# Altium schematic sheet AudioADC.SchDoc
size A4; SheetNumber: 3; SheetTotal: 4
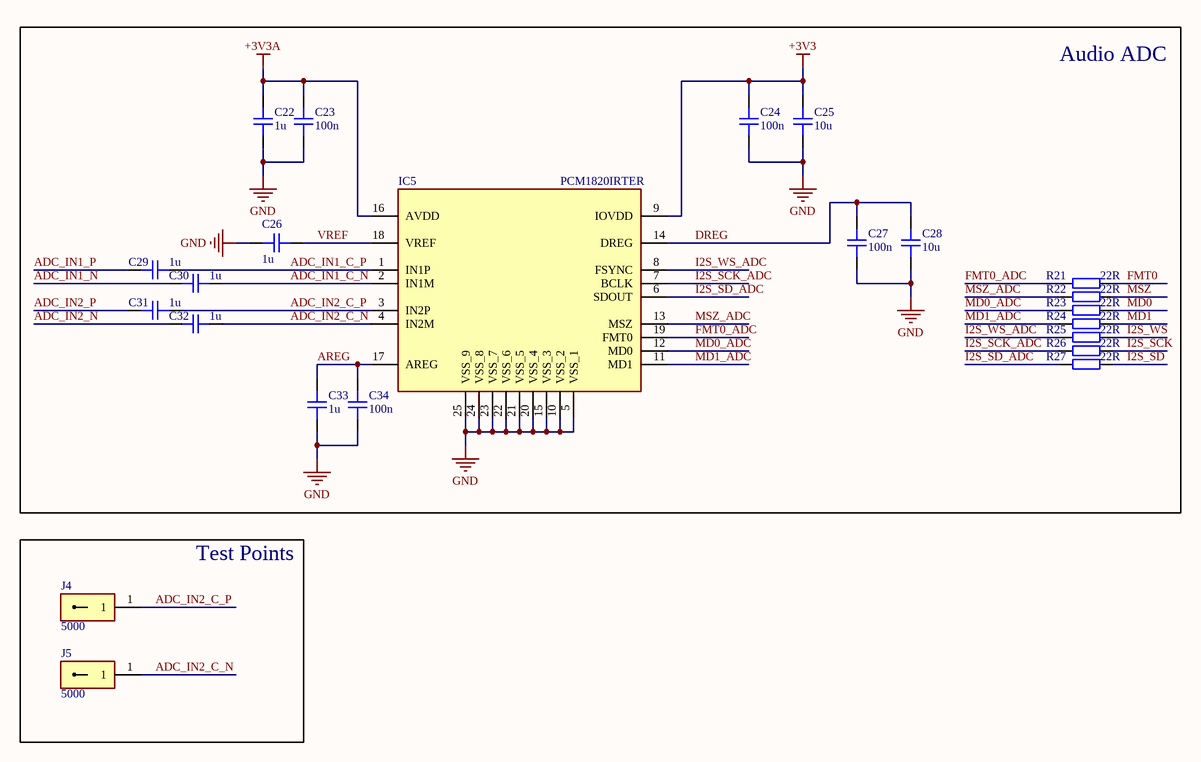
[diagram p0: AudioADC.SchDoc]

## Parts
C22  1u  [CAP_0603]
C23  100n  [CAP_0402]
C24  100n  [CAP_0402]
C25  10u  [CAP_0603]
C26  1u  [CAP_0402]
C27  100n  [CAP_0402]
C28  10u  [CAP_0603]
C29  1u  [CAP_0402]
C30  1u  [CAP_0402]
C31  1u  [CAP_0402]
C32  1u  [CAP_0402]
C33  1u  [CAP_0603]
C34  100n  [CAP_0402]
IC5  PCM1820IRTER  [PCM1820IRTER]
J4  5000  [5000]
J5  5000  [5000]
R21  22R  [RES_0402]
R22  22R  [RES_0402]
R23  22R  [RES_0402]
R24  22R  [RES_0402]
R25  22R  [RES_0402]
R26  22R  [RES_0402]
R27  22R  [RES_0402]

## Blocks framed on the sheet
Audio ADC: C22-C34 IC5 R21-R27
Test Points: J4 J5

## Nets
+3V3: C24.2 C25.2 IC5.9(IOVDD)
+3V3A: C22.2 C23.2 IC5.16(AVDD)
GND: C22.1 C23.1 C24.1 C25.1 C26.1 C27.1 C28.1 C33.1 C34.1 IC5.5(VSS_1) IC5.10(VSS_2) IC5.15(VSS_3) IC5.20(VSS_4) IC5.21(VSS_5) IC5.22(VSS_6) IC5.23(VSS_7) IC5.24(VSS_8) IC5.25(VSS_9)
ADC_IN1_C_N: C30.2 IC5.2(IN1M)
ADC_IN1_C_P: C29.2 IC5.1(IN1P)
ADC_IN1_N: C30.1
ADC_IN1_P: C29.1
ADC_IN2_C_N: C32.2 IC5.4(IN2M) J5.1
ADC_IN2_C_P: C31.2 IC5.3(IN2P) J4.1
ADC_IN2_N: C32.1
ADC_IN2_P: C31.1
AREG: C33.2 C34.2 IC5.17(AREG)
DREG: C27.2 C28.2 IC5.14(DREG)
FMT0: R21.2
FMT0_ADC: IC5.19(FMT0) R21.1
I2S_SCK: R26.2
I2S_SCK_ADC: IC5.7(BCLK) R26.1
I2S_SD: R27.2
I2S_SD_ADC: IC5.6(SDOUT) R27.1
I2S_WS: R25.2
I2S_WS_ADC: IC5.8(FSYNC) R25.1
MD0: R23.2
MD0_ADC: IC5.12(MD0) R23.1
MD1: R24.2
MD1_ADC: IC5.11(MD1) R24.1
MSZ: R22.2
MSZ_ADC: IC5.13(MSZ) R22.1
VREF: C26.2 IC5.18(VREF)

## Library data of the parts
C22 C25 C28 C33 = CAP_0603: Capacitor SMD 0603; Manufacturer: *; Manufacturer Part Number: *; Distributor Link: *; LCSC: *; Rating: *; Dielectric: *
C23 C24 C26 C27 C29-C32 C34 = CAP_0402: Capacitor SMD 0402; Manufacturer: *; Manufacturer Part Number: *; Distributor Link: *; LCSC: *; Rating: *; Dielectric: *
IC5 = PCM1820IRTER: Integrated Circuit; Manufacturer_Name: Texas Instruments; Datasheet Link: https://www.ti.com/lit/gpn/PCM1820; Height: 0.8mm; Manufacturer_Part_Number: PCM1820IRTER; Mouser Part Number: 595-PCM1820IRTER; Mouser Price/Stock: https://www.mouser.co.uk/ProductDetail/Texas-Instruments/PCM1820IRTER?qs=QNEnbhJQKvZFgZSjg2VzHg%3D%3D; Arrow Part Number: PCM1820IRTER; Arrow Price/Stock: https://www.arrow.com/en/products/pcm1820irter/texas-instruments?region=nac
J4 J5 = 5000: Connector; Manufacturer_Name: Keystone Electronics; Datasheet Link: http://www.keyelco.com/product-pdf.cfm?p=1309; Manufacturer_Part_Number: 5000; Mouser Part Number: 534-5000; Mouser Price/Stock: https://www.mouser.co.uk/ProductDetail/Keystone-Electronics/5000?qs=q0tsjPZWdm%252B9SiiTAbEwUw%3D%3D; Arrow Part Number: 5000; Arrow Price/Stock: https://www.arrow.com/en/products/5000/keystone-electronics?region=europe
R21-R27 = RES_0402: Resistor SMD 0402; Manufacturer: *; Manufacturer Part Number: *; Distributor Link: *; LCSC: *